# Altium schematic sheet Title Page.SchDoc
size A4; SheetNumber: 1; SheetTotal: 8
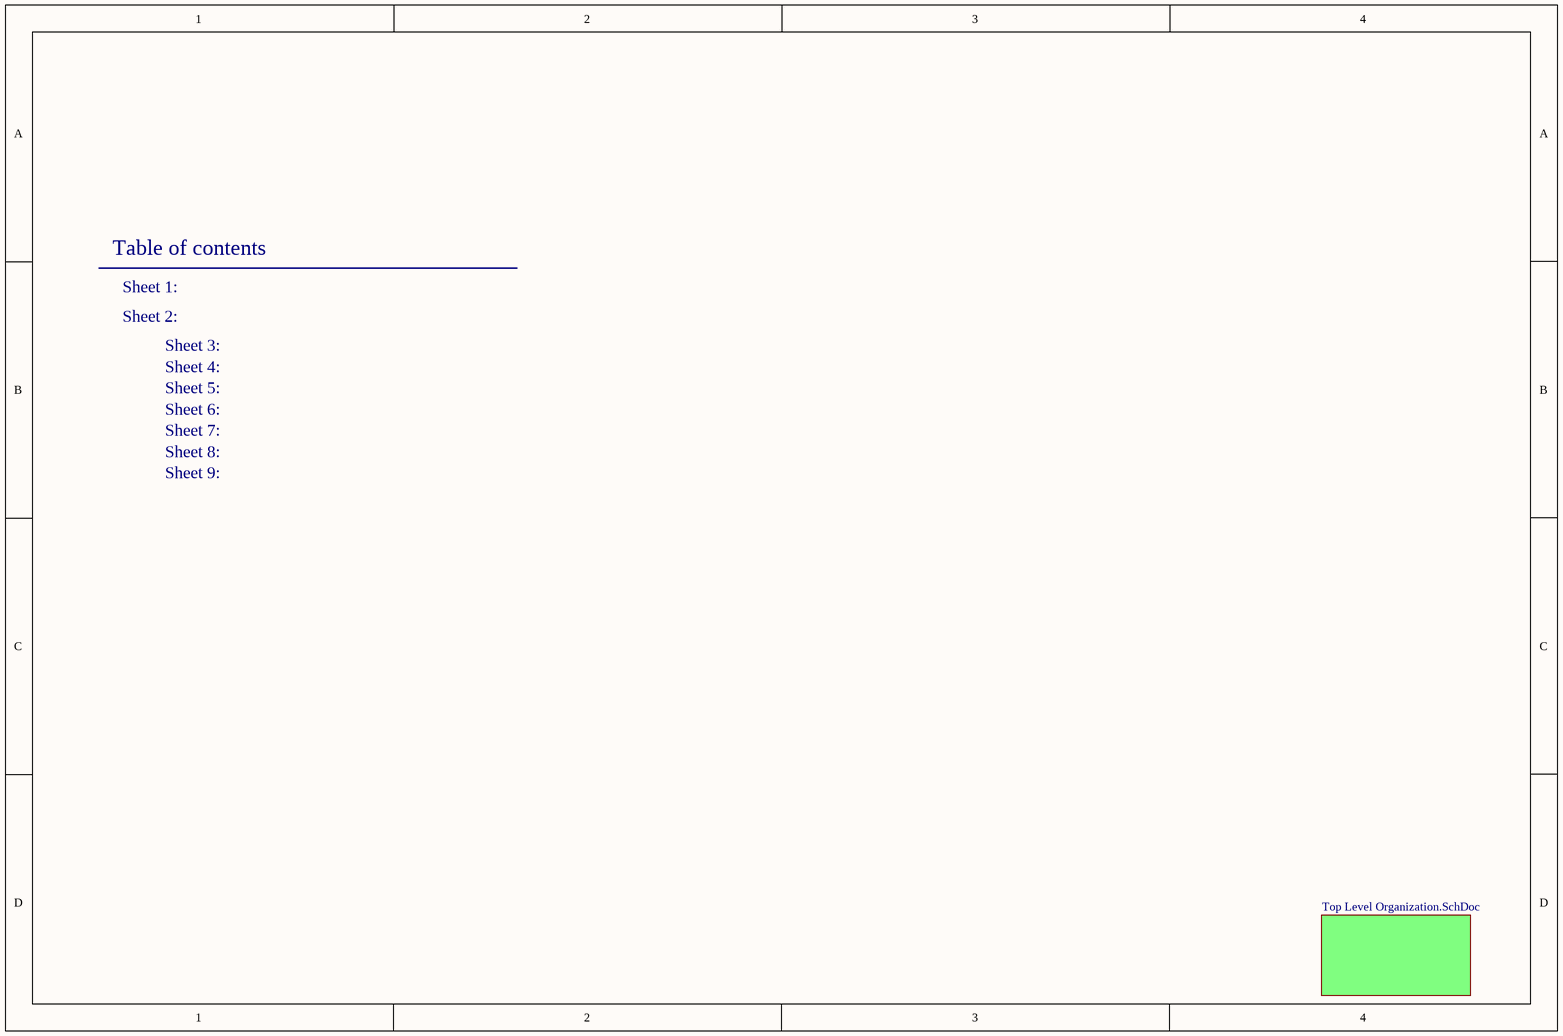
[diagram p0: Title Page.SchDoc]

## Sub-sheets
Designator = Top Level Organization.SchDoc: no entries

## Notes on the sheet
- Table of contents
- Sheet 1:
- Sheet 2:
- Sheet 4:
- Sheet 3:
- Sheet 5:
- Sheet 6:
- Sheet 7:
- Sheet 8:
- Sheet 9: